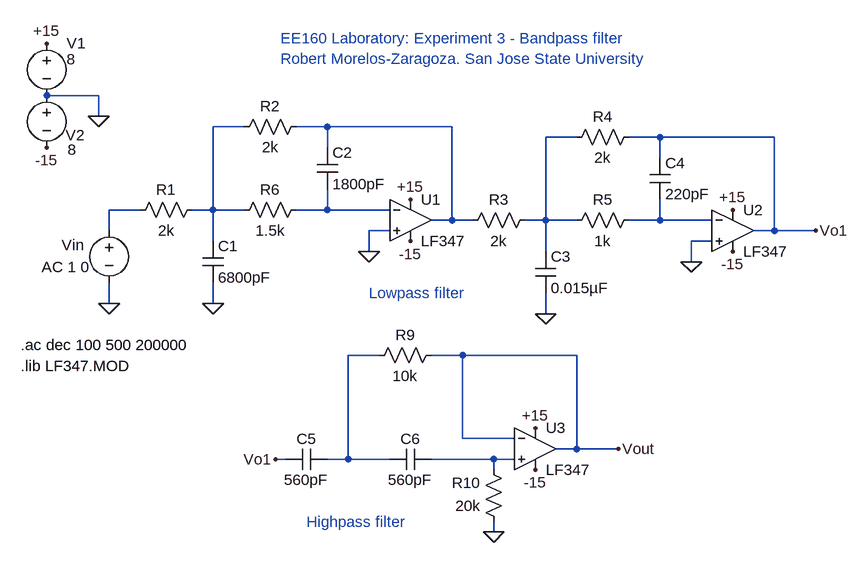
[diagram p0: schematic exp3_BPF.asc]
exp3_BPF.asc, the LTspice schematic file:
Version 4
SHEET 1 880 680
WIRE -880 -800 -960 -800
WIRE -880 -768 -880 -800
WIRE -656 -752 -704 -752
WIRE -528 -752 -576 -752
WIRE -336 -752 -528 -752
WIRE -144 -736 -192 -736
WIRE -16 -736 -64 -736
WIRE 160 -736 -16 -736
WIRE -528 -720 -528 -752
WIRE -16 -704 -16 -736
WIRE -816 -624 -864 -624
WIRE -704 -624 -704 -752
WIRE -704 -624 -736 -624
WIRE -656 -624 -704 -624
WIRE -528 -624 -528 -656
WIRE -528 -624 -576 -624
WIRE -432 -624 -528 -624
WIRE -336 -608 -336 -752
WIRE -336 -608 -368 -608
WIRE -304 -608 -336 -608
WIRE -192 -608 -192 -736
WIRE -192 -608 -224 -608
WIRE -144 -608 -192 -608
WIRE -16 -608 -16 -640
WIRE -16 -608 -64 -608
WIRE 64 -608 -16 -608
WIRE -864 -592 -864 -624
WIRE -432 -592 -464 -592
WIRE 160 -592 160 -736
WIRE 160 -592 128 -592
WIRE 224 -592 160 -592
WIRE -704 -576 -704 -624
WIRE 64 -576 32 -576
WIRE -464 -560 -464 -592
WIRE -192 -560 -192 -608
WIRE 32 -544 32 -576
WIRE -864 -480 -864 -512
WIRE -704 -480 -704 -512
WIRE -192 -464 -192 -496
WIRE -448 -400 -496 -400
WIRE -320 -400 -368 -400
WIRE -144 -400 -320 -400
WIRE -320 -272 -320 -400
WIRE -240 -272 -320 -272
WIRE -144 -256 -144 -400
WIRE -144 -256 -176 -256
WIRE -80 -256 -144 -256
WIRE -592 -240 -608 -240
WIRE -496 -240 -496 -400
WIRE -496 -240 -528 -240
WIRE -432 -240 -496 -240
WIRE -272 -240 -368 -240
WIRE -240 -240 -272 -240
WIRE -272 -224 -272 -240
WIRE -272 -128 -272 -144
FLAG -880 -768 0
FLAG -960 -880 +15
FLAG -960 -720 -15
FLAG -400 -640 +15
FLAG -400 -576 -15
FLAG -864 -480 0
FLAG -464 -560 0
FLAG -704 -480 0
FLAG 96 -624 +15
FLAG 96 -560 -15
FLAG 32 -544 0
FLAG -192 -464 0
FLAG 224 -592 Vo1
FLAG -208 -288 +15
FLAG -208 -224 -15
FLAG -272 -128 0
FLAG -80 -256 Vout
FLAG -608 -240 Vo1
SYMBOL opamp2 -400 -672 R0
SYMATTR InstName U1
SYMATTR Value LF347
SYMBOL voltage -960 -896 R0
WINDOW 0 31 15 Left 2
WINDOW 3 31 40 Left 2
WINDOW 123 0 0 Left 2
WINDOW 39 0 0 Left 2
SYMATTR InstName V1
SYMATTR Value 8
SYMBOL voltage -960 -816 R0
WINDOW 0 29 77 Left 2
WINDOW 3 32 99 Left 2
WINDOW 123 0 0 Left 2
WINDOW 39 0 0 Left 2
SYMATTR InstName V2
SYMATTR Value 8
SYMBOL voltage -864 -608 R0
WINDOW 123 -104 72 Left 2
WINDOW 39 0 0 Left 2
WINDOW 0 -73 38 Left 2
SYMATTR Value2 AC 1 0
SYMATTR InstName Vin
SYMATTR Value ""
SYMBOL res -832 -608 R270
WINDOW 0 32 56 VTop 2
WINDOW 3 0 56 VBottom 2
SYMATTR InstName R1
SYMATTR Value 2k
SYMBOL cap -720 -576 R0
SYMATTR InstName C1
SYMATTR Value 6800pF
SYMBOL res -672 -736 R270
WINDOW 0 32 56 VTop 2
WINDOW 3 0 56 VBottom 2
SYMATTR InstName R2
SYMATTR Value 2k
SYMBOL res -672 -608 R270
WINDOW 0 32 56 VTop 2
WINDOW 3 0 56 VBottom 2
SYMATTR InstName R6
SYMATTR Value 1.5k
SYMBOL cap -544 -720 R0
SYMATTR InstName C2
SYMATTR Value 1800pF
SYMBOL opamp2 96 -656 R0
SYMATTR InstName U2
SYMATTR Value LF347
SYMBOL res -320 -592 R270
WINDOW 0 32 56 VTop 2
WINDOW 3 0 56 VBottom 2
SYMATTR InstName R3
SYMATTR Value 2k
SYMBOL cap -208 -560 R0
SYMATTR InstName C3
SYMATTR Value 0.015µF
SYMBOL res -160 -720 R270
WINDOW 0 32 56 VTop 2
WINDOW 3 0 56 VBottom 2
SYMATTR InstName R4
SYMATTR Value 2k
SYMBOL res -160 -592 R270
WINDOW 0 32 56 VTop 2
WINDOW 3 0 56 VBottom 2
SYMATTR InstName R5
SYMATTR Value 1k
SYMBOL opamp2 -208 -320 R0
SYMATTR InstName U3
SYMATTR Value LF347
SYMBOL res -464 -384 R270
WINDOW 0 32 56 VTop 2
WINDOW 3 0 56 VBottom 2
SYMATTR InstName R9
SYMATTR Value 10k
SYMBOL cap -32 -704 R0
SYMATTR InstName C4
SYMATTR Value 220pF
SYMBOL cap -592 -224 R270
WINDOW 0 32 32 VTop 2
WINDOW 3 0 32 VBottom 2
SYMATTR InstName C5
SYMATTR Value 560pF
SYMBOL cap -432 -224 R270
WINDOW 0 32 32 VTop 2
WINDOW 3 0 32 VBottom 2
SYMATTR InstName C6
SYMATTR Value 560pF
SYMBOL res -256 -128 R180
WINDOW 0 36 76 Left 2
WINDOW 3 36 40 Left 2
SYMATTR InstName R10
SYMATTR Value 20k
TEXT -1000 -384 Left 2 !.lib LF347.MOD
TEXT -1000 -416 Left 2 !.ac dec 100 500 200000
TEXT -600 -888 Left 2 ;EE160 Laboratory: Experiment 3 - Bandpass filter\nRobert Morelos-Zaragoza. San Jose State University
TEXT -560 -144 Left 2 ;Highpass filter
TEXT -464 -496 Left 2 ;Lowpass filter

The netlist it stands for:
* exp3_BPF.asc
XU1 0 N005 +15 -15 N002 LF347  ; pins In+ In- V+ V- OUT
V1 +15 0 8
V2 0 -15 8
Vin N004 0 AC 1 0
R1 N004 N001 2k
C1 N001 0 6800pF
R2 N001 N002 2k
R6 N001 N005 1.5k
C2 N002 N005 1800pF
XU2 0 N006 +15 -15 Vo1 LF347  ; pins In+ In- V+ V- OUT
R3 N002 N003 2k
C3 N003 0 0.015µF
R4 N003 Vo1 2k
R5 N003 N006 1k
XU3 N008 Vout +15 -15 Vout LF347  ; pins In+ In- V+ V- OUT
R9 N007 Vout 10k
C4 Vo1 N006 220pF
C5 Vo1 N007 560pF
C6 N007 N008 560pF
R10 0 N008 20k
.lib LF347.MOD
.ac dec 100 500 200000
* EE160 Laboratory: Experiment 3 - Bandpass filter
* Robert Morelos-Zaragoza. San Jose State University
* Highpass filter
* Lowpass filter
.backanno
.end